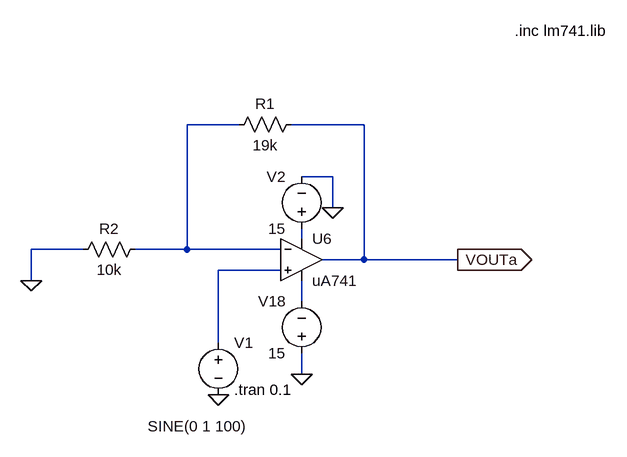
[diagram p0: schematic inverting amplifier .asc]
inverting amplifier .asc, the LTspice schematic file:
Version 4.1
SHEET 1 4784 2492
WIRE 752 1248 672 1248
WIRE 944 1248 832 1248
WIRE 896 1328 848 1328
WIRE 896 1376 896 1328
WIRE 848 1424 848 1408
WIRE 512 1440 432 1440
WIRE 672 1440 672 1248
WIRE 672 1440 592 1440
WIRE 816 1440 672 1440
WIRE 944 1456 944 1248
WIRE 944 1456 880 1456
WIRE 1088 1456 944 1456
WIRE 816 1472 720 1472
WIRE 432 1488 432 1440
WIRE 848 1520 848 1488
WIRE 720 1584 720 1472
WIRE 848 1632 848 1600
FLAG 848 1632 0
FLAG 1088 1456 VOUTa
IOPIN 1088 1456 Out
FLAG 896 1376 0
FLAG 720 1664 0
FLAG 432 1488 0
SYMBOL OpAmps\\opamp2 848 1392 R0
SYMATTR InstName U6
SYMATTR Value uA741
SYMBOL voltage 848 1616 R180
WINDOW 0 24 96 Left 2
WINDOW 3 24 16 Left 2
WINDOW 123 0 0 Left 0
WINDOW 39 0 0 Left 0
SYMATTR InstName V18
SYMATTR Value 15
SYMBOL voltage 848 1424 R180
WINDOW 0 24 96 Left 2
WINDOW 3 24 16 Left 2
WINDOW 123 0 0 Left 0
WINDOW 39 0 0 Left 0
SYMATTR InstName V2
SYMATTR Value 15
SYMBOL res 608 1424 R90
WINDOW 0 0 56 VBottom 2
WINDOW 3 32 56 VTop 2
SYMATTR InstName R2
SYMATTR Value 10k
SYMBOL voltage 720 1568 R0
WINDOW 3 -109 144 Left 2
WINDOW 123 0 0 Left 0
WINDOW 39 0 0 Left 0
SYMATTR Value SINE(0 1 100)
SYMATTR InstName V1
SYMBOL res 848 1232 R90
WINDOW 0 0 56 VBottom 2
WINDOW 3 32 56 VTop 2
SYMATTR InstName R1
SYMATTR Value 19k
TEXT 744 1656 Left 2 !.tran 0.1
TEXT 1176 1104 Left 2 !.inc lm741.lib

The netlist it stands for:
* inverting amplifier .asc
X§U6 N003 N001 N002 N004 VOUTa uA741  ; pins In+ In- V+ V- OUT
V18 0 N004 15
V2 N002 0 15
R2 N001 0 10k
V1 N003 0 SINE(0 1 100)
R1 VOUTa N001 19k
.tran 0.1
.inc lm741.lib
.backanno
.end